# Altium project zb_hub.PrjPcb
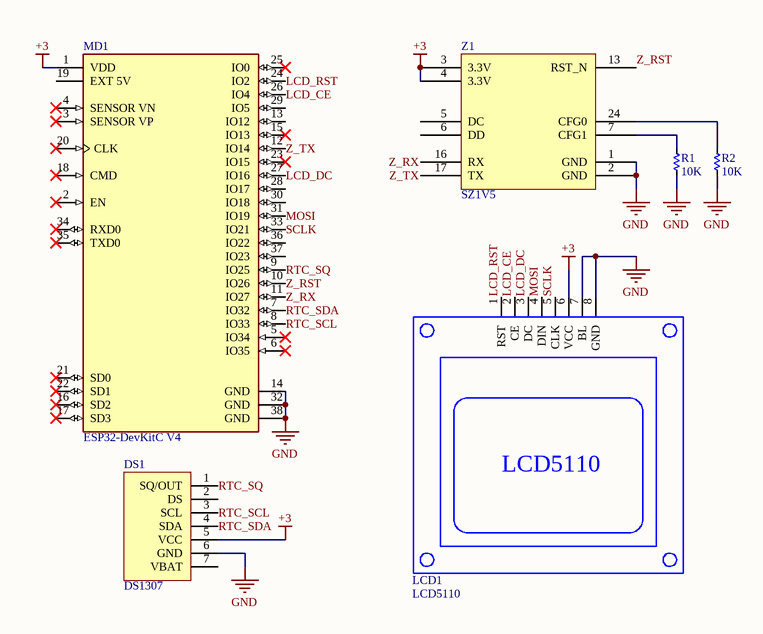
[diagram p0: zb_hub.SchDoc]
1 sheet, 6 parts. Net scope: global (net labels, ports and power ports of the same name join across sheets).
Board file: zb_hub.PcbDoc

## Sheet zb_hub.SchDoc
size A; SheetNumber: 1; SheetTotal: 1

### Parts
DS1  DS1307  [DS1307]
LCD1  LCD5110  [LCD5110]
MD1  ESP32-DevKitC V4  [FP-ESP32-DevKitC_V4-MFG]
R1  10K  [RES-1/2W]
R2  10K  [RES-1/2W]
Z1  SZ1V5  [SZ1V5 PINOUT MODULE]

### Nets
+3: DS1.5(VCC) LCD1.6(VCC) MD1.1(VDD) Z1.3(3.3V) Z1.4(3.3V)
GND: DS1.6(GND) LCD1.7(BL) LCD1.8(GND) MD1.14(GND) MD1.32(GND) MD1.38(GND) R1.2 R2.2 Z1.1(GND) Z1.2(GND)
LCD_CE: LCD1.2(CE) MD1.26(IO4)
LCD_DC: LCD1.3(DC) MD1.27(IO16)
LCD_RST: LCD1.1(RST) MD1.24(IO2)
MOSI: LCD1.4(DIN) MD1.31(IO19)
RTC_SCL: DS1.3(SCL) MD1.8(IO33)
RTC_SDA: DS1.4(SDA) MD1.7(IO32)
RTC_SQ: DS1.1(SQ/OUT) MD1.9(IO25)
SCLK: LCD1.5(CLK) MD1.33(IO21)
Z_RST: MD1.10(IO26) Z1.13(RST_N)
Z_RX: MD1.11(IO27) Z1.16(RX)
Z_TX: MD1.12(IO14) Z1.17(TX)
NetR1_1: R1.1 Z1.7(CFG1)
NetR2_1: R2.1 Z1.24(CFG0)

Not connected (* = marked no-connect by the designer): DS1 2(DS) 7(VBAT); MD1 2(EN)* 3(SENSOR_VP)* 4(SENSOR_VN)* 5(IO34)* 6(IO35)* 13(IO12) 15(IO13)* 16(SD2)* 17(SD3)* 18(CMD)* 19(EXT_5V) 20(CLK)* 21(SD0)* 22(SD1)* 23(IO15)* 25(IO0)* 28(IO17) 29(IO5) 30(IO18) 34(RXD0)* 35(TXD0)* 36(IO22) 37(IO23); Z1 5(DC) 6(DD)

### Library data of the parts
DS1 = DS1307: Tiny RTC I2C module DS1307
LCD1 = LCD5110: IC Philips PCD8544. 3V~5V, 84×48 pixels
MD1 = CMP-194065-000004-1: WiFi Development Tools (802.11) ESP32 General Development Kit, ESP32-WROOM-32 on the board; Manufacturer: Espressif; Number Of Adc Channels: 16; Max Supply Voltage: 5V; Bandwidth: 2.4-2.5GHz; Interface: I2C,SPI,UART,I2S; Max Frequency: 2.5GHz; Min Supply Voltage: 2.7V; Number Of Gpio: 22; Package: ESP32-DevKitC V4; Device Class L2: RF Semiconductors and Devices; Device Class L3: Transceivers; ComponentLink2Description: Datasheet; Temperature Range Low: -40°C; ComponentLink2URL: https://docs.espressif.com/projects/esp-idf/en/latest/get-started/get-started-devkitc.html; RoHS: TRUE; Category: UNK; Automotive: No; Device Class L1: Integrated Circuits (ICs); Manufacturer Part Number: ESP32-DevKitC V4; Octopart: https://octopart.com/esp32-devkitc+v4-espressif+systems-107467262; Lead Free: Yes; Temperature: -40°C to
R1 R2 = Res: Manufacturer: Generic Components; Class: Passive; SubClass: R; Published: 08/06/2000; Publisher: Altium Hobart Technology Centre
Z1 = SZ1V5_Alt